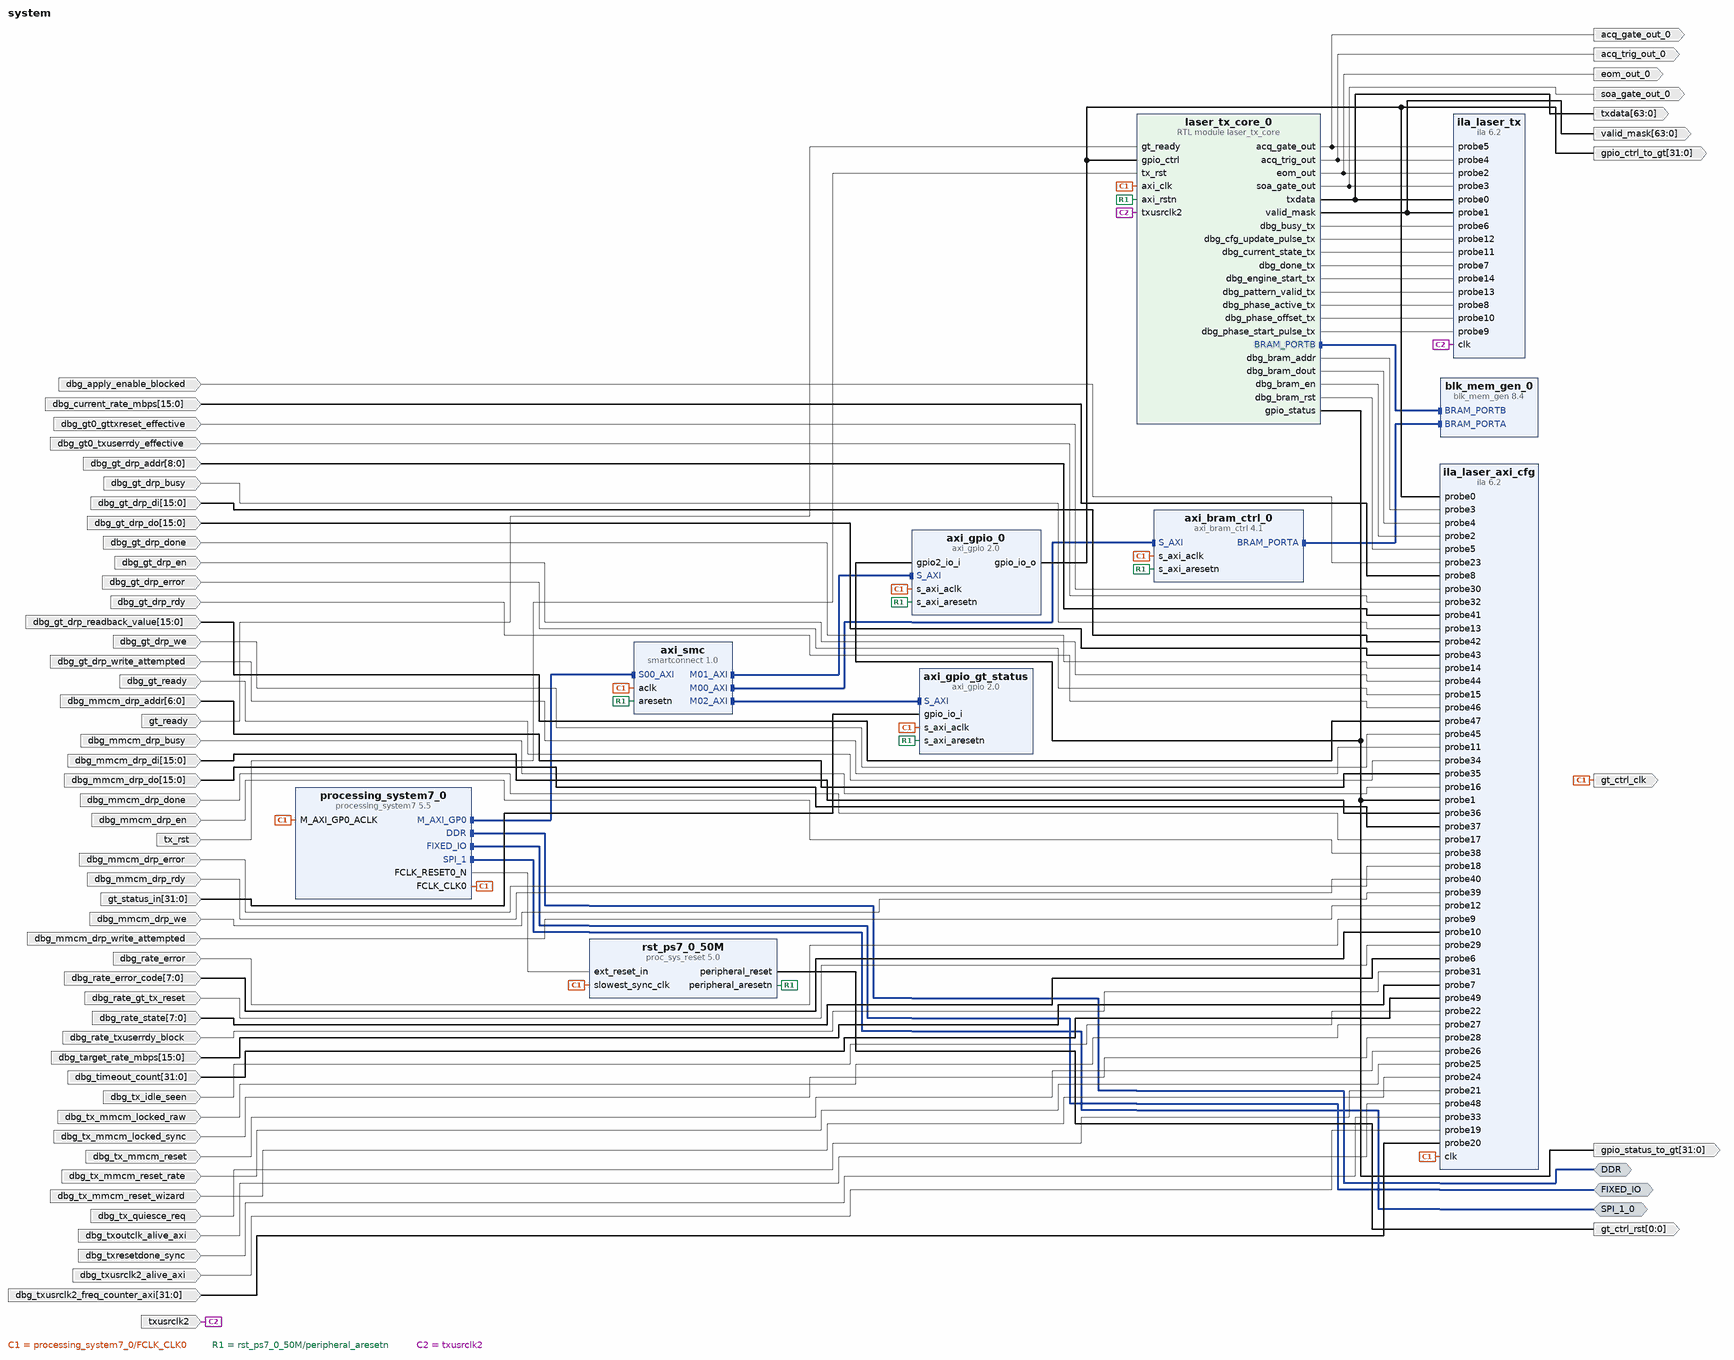
[diagram p0: block diagram of the top level]
# Vivado block design system, xc7z100ffg900-2, Vivado 2022.2
create_bd_design system

create_bd_intf_port -mode Master -vlnv xilinx.com:interface:ddrx_rtl:1.0 DDR
create_bd_intf_port -mode Master -vlnv xilinx.com:display_processing_system7:fixedio_rtl:1.0 FIXED_IO
create_bd_intf_port -mode Master -vlnv xilinx.com:interface:spi_rtl:1.0 SPI_1_0
create_bd_port -dir O acq_trig_out_0
create_bd_port -dir O soa_gate_out_0
create_bd_port -dir O acq_gate_out_0
create_bd_port -dir O eom_out_0
create_bd_port -dir O gt_ctrl_clk
create_bd_port -dir O -from 0 -to 0 gt_ctrl_rst
create_bd_port -dir I txusrclk2
create_bd_port -dir I tx_rst
create_bd_port -dir I gt_ready
create_bd_port -dir O -from 63 -to 0 txdata
create_bd_port -dir O -from 63 -to 0 valid_mask
create_bd_port -dir I -from 31 -to 0 gt_status_in
create_bd_port -dir O -from 31 -to 0 gpio_ctrl_to_gt
create_bd_port -dir O -from 31 -to 0 gpio_status_to_gt
create_bd_port -dir I -from 7 -to 0 dbg_rate_state
create_bd_port -dir I -from 15 -to 0 dbg_target_rate_mbps
create_bd_port -dir I -from 15 -to 0 dbg_current_rate_mbps
create_bd_port -dir I dbg_rate_error
create_bd_port -dir I -from 7 -to 0 dbg_rate_error_code
create_bd_port -dir I dbg_gt_drp_write_attempted
create_bd_port -dir I dbg_mmcm_drp_write_attempted
create_bd_port -dir I dbg_gt_drp_busy
create_bd_port -dir I dbg_gt_drp_done
create_bd_port -dir I dbg_gt_drp_error
create_bd_port -dir I dbg_mmcm_drp_busy
create_bd_port -dir I dbg_mmcm_drp_done
create_bd_port -dir I dbg_mmcm_drp_error
create_bd_port -dir I dbg_txusrclk2_alive_axi
create_bd_port -dir I -from 31 -to 0 dbg_txusrclk2_freq_counter_axi
create_bd_port -dir I dbg_tx_quiesce_req
create_bd_port -dir I dbg_tx_idle_seen
create_bd_port -dir I dbg_apply_enable_blocked
create_bd_port -dir I dbg_tx_mmcm_reset_wizard
create_bd_port -dir I dbg_tx_mmcm_reset_rate
create_bd_port -dir I dbg_tx_mmcm_reset
create_bd_port -dir I dbg_tx_mmcm_locked_raw
create_bd_port -dir I dbg_tx_mmcm_locked_sync
create_bd_port -dir I dbg_rate_gt_tx_reset
create_bd_port -dir I dbg_gt0_gttxreset_effective
create_bd_port -dir I dbg_rate_txuserrdy_block
create_bd_port -dir I dbg_gt0_txuserrdy_effective
create_bd_port -dir I dbg_txresetdone_sync
create_bd_port -dir I dbg_gt_ready
create_bd_port -dir I -from 6 -to 0 dbg_mmcm_drp_addr
create_bd_port -dir I -from 15 -to 0 dbg_mmcm_drp_di
create_bd_port -dir I -from 15 -to 0 dbg_mmcm_drp_do
create_bd_port -dir I dbg_mmcm_drp_en
create_bd_port -dir I dbg_mmcm_drp_we
create_bd_port -dir I dbg_mmcm_drp_rdy
create_bd_port -dir I -from 8 -to 0 dbg_gt_drp_addr
create_bd_port -dir I -from 15 -to 0 dbg_gt_drp_di
create_bd_port -dir I -from 15 -to 0 dbg_gt_drp_do
create_bd_port -dir I dbg_gt_drp_en
create_bd_port -dir I dbg_gt_drp_we
create_bd_port -dir I dbg_gt_drp_rdy
create_bd_port -dir I -from 15 -to 0 dbg_gt_drp_readback_value
create_bd_port -dir I dbg_txoutclk_alive_axi
create_bd_port -dir I -from 31 -to 0 dbg_timeout_count

create_bd_cell -type ip -vlnv xilinx.com:ip:processing_system7:5.5 processing_system7_0
set_property -dict [list \
  CONFIG.PCW_ENET0_ENET0_IO {MIO 16 .. 27} \
  CONFIG.PCW_ENET0_GRP_MDIO_ENABLE 1 \
  CONFIG.PCW_ENET0_GRP_MDIO_IO {MIO 52 .. 53} \
  CONFIG.PCW_ENET0_PERIPHERAL_ENABLE 1 \
  CONFIG.PCW_PRESET_BANK0_VOLTAGE {LVCMOS 1.8V} \
  CONFIG.PCW_PRESET_BANK1_VOLTAGE {LVCMOS 1.8V} \
  CONFIG.PCW_SD0_GRP_CD_ENABLE 0 \
  CONFIG.PCW_SD0_GRP_WP_ENABLE 0 \
  CONFIG.PCW_SD0_PERIPHERAL_ENABLE 1 \
  CONFIG.PCW_SD0_SD0_IO {MIO 40 .. 45} \
  CONFIG.PCW_SD1_PERIPHERAL_ENABLE 1 \
  CONFIG.PCW_SD1_SD1_IO {MIO 10 .. 15} \
  CONFIG.PCW_SDIO_PERIPHERAL_FREQMHZ 100 \
  CONFIG.PCW_SPI1_PERIPHERAL_ENABLE 1 \
  CONFIG.PCW_SPI1_SPI1_IO EMIO \
  CONFIG.PCW_UART1_PERIPHERAL_ENABLE 1 \
  CONFIG.PCW_UART1_UART1_IO {MIO 48 .. 49} \
  CONFIG.PCW_UART_PERIPHERAL_FREQMHZ 100 \
  CONFIG.PCW_UIPARAM_DDR_PARTNO {MT41J256M16 RE-125} \
  CONFIG.PCW_USB0_PERIPHERAL_ENABLE 1 \
  CONFIG.PCW_USB0_USB0_IO {MIO 28 .. 39} \
] [get_bd_cells processing_system7_0]
# 172 more settings of processing_system7_0 are not shown: defaults, MIO pin electricals, DDR timing, and values the tool derives
create_bd_cell -type ip -vlnv xilinx.com:ip:axi_bram_ctrl:4.1 axi_bram_ctrl_0
set_property -dict {CONFIG.SINGLE_PORT_BRAM 1} [get_bd_cells axi_bram_ctrl_0]
create_bd_cell -type ip -vlnv xilinx.com:ip:blk_mem_gen:8.4 blk_mem_gen_0
set_property -dict [list \
  CONFIG.Assume_Synchronous_Clk false \
  CONFIG.EN_SAFETY_CKT false \
  CONFIG.Enable_B Use_ENB_Pin \
  CONFIG.Memory_Type True_Dual_Port_RAM \
  CONFIG.Register_PortB_Output_of_Memory_Core false \
  CONFIG.Register_PortB_Output_of_Memory_Primitives false \
] [get_bd_cells blk_mem_gen_0]
create_bd_cell -type ip -vlnv xilinx.com:ip:axi_gpio:2.0 axi_gpio_0
set_property -dict [list \
  CONFIG.C_ALL_INPUTS_2 1 \
  CONFIG.C_ALL_OUTPUTS 1 \
  CONFIG.C_GPIO2_WIDTH 32 \
  CONFIG.C_GPIO_WIDTH 32 \
  CONFIG.C_IS_DUAL 1 \
] [get_bd_cells axi_gpio_0]
create_bd_cell -type ip -vlnv xilinx.com:ip:smartconnect:1.0 axi_smc
set_property -dict {CONFIG.NUM_MI 3 CONFIG.NUM_SI 1} [get_bd_cells axi_smc]
create_bd_cell -type ip -vlnv xilinx.com:ip:proc_sys_reset:5.0 rst_ps7_0_50M
create_bd_cell -type ip -vlnv xilinx.com:ip:ila:6.2 ila_laser_axi_cfg
set_property -dict [list \
  CONFIG.C_ADV_TRIGGER true \
  CONFIG.C_DATA_DEPTH 4096 \
  CONFIG.C_MONITOR_TYPE Native \
  CONFIG.C_NUM_OF_PROBES 50 \
  CONFIG.C_PROBE0_WIDTH 32 \
  CONFIG.C_PROBE10_WIDTH 8 \
  CONFIG.C_PROBE11_WIDTH 1 \
  CONFIG.C_PROBE12_WIDTH 1 \
  CONFIG.C_PROBE13_WIDTH 1 \
  CONFIG.C_PROBE14_WIDTH 1 \
  CONFIG.C_PROBE15_WIDTH 1 \
  CONFIG.C_PROBE16_WIDTH 1 \
  CONFIG.C_PROBE17_WIDTH 1 \
  CONFIG.C_PROBE18_WIDTH 1 \
  CONFIG.C_PROBE19_WIDTH 1 \
  CONFIG.C_PROBE1_WIDTH 32 \
  CONFIG.C_PROBE20_WIDTH 32 \
  CONFIG.C_PROBE21_WIDTH 1 \
  CONFIG.C_PROBE22_WIDTH 1 \
  CONFIG.C_PROBE23_WIDTH 1 \
  CONFIG.C_PROBE24_WIDTH 1 \
  CONFIG.C_PROBE25_WIDTH 1 \
  CONFIG.C_PROBE26_WIDTH 1 \
  CONFIG.C_PROBE27_WIDTH 1 \
  CONFIG.C_PROBE28_WIDTH 1 \
  CONFIG.C_PROBE29_WIDTH 1 \
  CONFIG.C_PROBE2_WIDTH 1 \
  CONFIG.C_PROBE30_WIDTH 1 \
  CONFIG.C_PROBE31_WIDTH 1 \
  CONFIG.C_PROBE32_WIDTH 1 \
  CONFIG.C_PROBE33_WIDTH 1 \
  CONFIG.C_PROBE34_WIDTH 1 \
  CONFIG.C_PROBE35_WIDTH 7 \
  CONFIG.C_PROBE36_WIDTH 16 \
  CONFIG.C_PROBE37_WIDTH 16 \
  CONFIG.C_PROBE38_WIDTH 1 \
  CONFIG.C_PROBE39_WIDTH 1 \
  CONFIG.C_PROBE3_WIDTH 32 \
  CONFIG.C_PROBE40_WIDTH 1 \
  CONFIG.C_PROBE41_WIDTH 9 \
  CONFIG.C_PROBE42_WIDTH 16 \
  CONFIG.C_PROBE43_WIDTH 16 \
  CONFIG.C_PROBE44_WIDTH 1 \
  CONFIG.C_PROBE45_WIDTH 1 \
  CONFIG.C_PROBE46_WIDTH 1 \
  CONFIG.C_PROBE47_WIDTH 16 \
  CONFIG.C_PROBE48_WIDTH 1 \
  CONFIG.C_PROBE49_WIDTH 32 \
  CONFIG.C_PROBE4_WIDTH 32 \
  CONFIG.C_PROBE5_WIDTH 1 \
  CONFIG.C_PROBE6_WIDTH 8 \
  CONFIG.C_PROBE7_WIDTH 16 \
  CONFIG.C_PROBE8_WIDTH 16 \
  CONFIG.C_PROBE9_WIDTH 1 \
] [get_bd_cells ila_laser_axi_cfg]
create_bd_cell -type ip -vlnv xilinx.com:ip:ila:6.2 ila_laser_tx
set_property -dict [list \
  CONFIG.C_ADV_TRIGGER true \
  CONFIG.C_DATA_DEPTH 4096 \
  CONFIG.C_MONITOR_TYPE Native \
  CONFIG.C_NUM_OF_PROBES 15 \
  CONFIG.C_PROBE0_WIDTH 64 \
  CONFIG.C_PROBE10_WIDTH 8 \
  CONFIG.C_PROBE11_WIDTH 8 \
  CONFIG.C_PROBE12_WIDTH 1 \
  CONFIG.C_PROBE13_WIDTH 1 \
  CONFIG.C_PROBE14_WIDTH 1 \
  CONFIG.C_PROBE1_WIDTH 64 \
  CONFIG.C_PROBE2_WIDTH 1 \
  CONFIG.C_PROBE3_WIDTH 1 \
  CONFIG.C_PROBE4_WIDTH 1 \
  CONFIG.C_PROBE5_WIDTH 1 \
  CONFIG.C_PROBE6_WIDTH 1 \
  CONFIG.C_PROBE7_WIDTH 1 \
  CONFIG.C_PROBE8_WIDTH 1 \
  CONFIG.C_PROBE9_WIDTH 1 \
] [get_bd_cells ila_laser_tx]
create_bd_cell -type ip -vlnv xilinx.com:ip:axi_gpio:2.0 axi_gpio_gt_status
set_property -dict {CONFIG.C_ALL_INPUTS 1 CONFIG.C_GPIO_WIDTH 32 CONFIG.C_IS_DUAL 0} [get_bd_cells axi_gpio_gt_status]
create_bd_cell -type module -reference laser_tx_core laser_tx_core_0

# ---- connections ----

connect_bd_intf_net [get_bd_intf_pins blk_mem_gen_0/BRAM_PORTA] [get_bd_intf_pins axi_bram_ctrl_0/BRAM_PORTA]
connect_bd_intf_net [get_bd_intf_pins axi_smc/M00_AXI] [get_bd_intf_pins axi_bram_ctrl_0/S_AXI]
connect_bd_intf_net [get_bd_intf_pins axi_smc/M01_AXI] [get_bd_intf_pins axi_gpio_0/S_AXI]
connect_bd_intf_net [get_bd_intf_pins axi_smc/M02_AXI] [get_bd_intf_pins axi_gpio_gt_status/S_AXI]
connect_bd_intf_net [get_bd_intf_pins laser_tx_core_0/BRAM_PORTB] [get_bd_intf_pins blk_mem_gen_0/BRAM_PORTB]
connect_bd_intf_net [get_bd_intf_ports DDR] [get_bd_intf_pins processing_system7_0/DDR]
connect_bd_intf_net [get_bd_intf_ports FIXED_IO] [get_bd_intf_pins processing_system7_0/FIXED_IO]
connect_bd_intf_net [get_bd_intf_pins processing_system7_0/M_AXI_GP0] [get_bd_intf_pins axi_smc/S00_AXI]
connect_bd_intf_net [get_bd_intf_ports SPI_1_0] [get_bd_intf_pins processing_system7_0/SPI_1]
connect_bd_net [get_bd_pins axi_gpio_0/gpio_io_o] \
  [get_bd_pins ila_laser_axi_cfg/probe0] [get_bd_ports gpio_ctrl_to_gt] [get_bd_pins laser_tx_core_0/gpio_ctrl]
connect_bd_net [get_bd_ports dbg_apply_enable_blocked] [get_bd_pins ila_laser_axi_cfg/probe23]
connect_bd_net [get_bd_ports dbg_current_rate_mbps] [get_bd_pins ila_laser_axi_cfg/probe8]
connect_bd_net [get_bd_ports dbg_gt0_gttxreset_effective] [get_bd_pins ila_laser_axi_cfg/probe30]
connect_bd_net [get_bd_ports dbg_gt0_txuserrdy_effective] [get_bd_pins ila_laser_axi_cfg/probe32]
connect_bd_net [get_bd_ports dbg_gt_drp_addr] [get_bd_pins ila_laser_axi_cfg/probe41]
connect_bd_net [get_bd_ports dbg_gt_drp_busy] [get_bd_pins ila_laser_axi_cfg/probe13]
connect_bd_net [get_bd_ports dbg_gt_drp_di] [get_bd_pins ila_laser_axi_cfg/probe42]
connect_bd_net [get_bd_ports dbg_gt_drp_do] [get_bd_pins ila_laser_axi_cfg/probe43]
connect_bd_net [get_bd_ports dbg_gt_drp_done] [get_bd_pins ila_laser_axi_cfg/probe14]
connect_bd_net [get_bd_ports dbg_gt_drp_en] [get_bd_pins ila_laser_axi_cfg/probe44]
connect_bd_net [get_bd_ports dbg_gt_drp_error] [get_bd_pins ila_laser_axi_cfg/probe15]
connect_bd_net [get_bd_ports dbg_gt_drp_rdy] [get_bd_pins ila_laser_axi_cfg/probe46]
connect_bd_net [get_bd_ports dbg_gt_drp_readback_value] [get_bd_pins ila_laser_axi_cfg/probe47]
connect_bd_net [get_bd_ports dbg_gt_drp_we] [get_bd_pins ila_laser_axi_cfg/probe45]
connect_bd_net [get_bd_ports dbg_gt_drp_write_attempted] [get_bd_pins ila_laser_axi_cfg/probe11]
connect_bd_net [get_bd_ports dbg_gt_ready] [get_bd_pins ila_laser_axi_cfg/probe34]
connect_bd_net [get_bd_ports dbg_mmcm_drp_addr] [get_bd_pins ila_laser_axi_cfg/probe35]
connect_bd_net [get_bd_ports dbg_mmcm_drp_busy] [get_bd_pins ila_laser_axi_cfg/probe16]
connect_bd_net [get_bd_ports dbg_mmcm_drp_di] [get_bd_pins ila_laser_axi_cfg/probe36]
connect_bd_net [get_bd_ports dbg_mmcm_drp_do] [get_bd_pins ila_laser_axi_cfg/probe37]
connect_bd_net [get_bd_ports dbg_mmcm_drp_done] [get_bd_pins ila_laser_axi_cfg/probe17]
connect_bd_net [get_bd_ports dbg_mmcm_drp_en] [get_bd_pins ila_laser_axi_cfg/probe38]
connect_bd_net [get_bd_ports dbg_mmcm_drp_error] [get_bd_pins ila_laser_axi_cfg/probe18]
connect_bd_net [get_bd_ports dbg_mmcm_drp_rdy] [get_bd_pins ila_laser_axi_cfg/probe40]
connect_bd_net [get_bd_ports dbg_mmcm_drp_we] [get_bd_pins ila_laser_axi_cfg/probe39]
connect_bd_net [get_bd_ports dbg_mmcm_drp_write_attempted] [get_bd_pins ila_laser_axi_cfg/probe12]
connect_bd_net [get_bd_ports dbg_rate_error] [get_bd_pins ila_laser_axi_cfg/probe9]
connect_bd_net [get_bd_ports dbg_rate_error_code] [get_bd_pins ila_laser_axi_cfg/probe10]
connect_bd_net [get_bd_ports dbg_rate_gt_tx_reset] [get_bd_pins ila_laser_axi_cfg/probe29]
connect_bd_net [get_bd_ports dbg_rate_state] [get_bd_pins ila_laser_axi_cfg/probe6]
connect_bd_net [get_bd_ports dbg_rate_txuserrdy_block] [get_bd_pins ila_laser_axi_cfg/probe31]
connect_bd_net [get_bd_ports dbg_target_rate_mbps] [get_bd_pins ila_laser_axi_cfg/probe7]
connect_bd_net [get_bd_ports dbg_timeout_count] [get_bd_pins ila_laser_axi_cfg/probe49]
connect_bd_net [get_bd_ports dbg_tx_idle_seen] [get_bd_pins ila_laser_axi_cfg/probe22]
connect_bd_net [get_bd_ports dbg_tx_mmcm_locked_raw] [get_bd_pins ila_laser_axi_cfg/probe27]
connect_bd_net [get_bd_ports dbg_tx_mmcm_locked_sync] [get_bd_pins ila_laser_axi_cfg/probe28]
connect_bd_net [get_bd_ports dbg_tx_mmcm_reset] [get_bd_pins ila_laser_axi_cfg/probe26]
connect_bd_net [get_bd_ports dbg_tx_mmcm_reset_rate] [get_bd_pins ila_laser_axi_cfg/probe25]
connect_bd_net [get_bd_ports dbg_tx_mmcm_reset_wizard] [get_bd_pins ila_laser_axi_cfg/probe24]
connect_bd_net [get_bd_ports dbg_tx_quiesce_req] [get_bd_pins ila_laser_axi_cfg/probe21]
connect_bd_net [get_bd_ports dbg_txoutclk_alive_axi] [get_bd_pins ila_laser_axi_cfg/probe48]
connect_bd_net [get_bd_ports dbg_txresetdone_sync] [get_bd_pins ila_laser_axi_cfg/probe33]
connect_bd_net [get_bd_ports dbg_txusrclk2_alive_axi] [get_bd_pins ila_laser_axi_cfg/probe19]
connect_bd_net [get_bd_ports dbg_txusrclk2_freq_counter_axi] [get_bd_pins ila_laser_axi_cfg/probe20]
connect_bd_net [get_bd_ports gt_ready] [get_bd_pins laser_tx_core_0/gt_ready]
connect_bd_net [get_bd_ports gt_status_in] [get_bd_pins axi_gpio_gt_status/gpio_io_i]
connect_bd_net [get_bd_pins laser_tx_core_0/acq_gate_out] [get_bd_ports acq_gate_out_0] [get_bd_pins ila_laser_tx/probe5]
connect_bd_net [get_bd_pins laser_tx_core_0/acq_trig_out] [get_bd_ports acq_trig_out_0] [get_bd_pins ila_laser_tx/probe4]
connect_bd_net [get_bd_pins laser_tx_core_0/dbg_bram_addr] [get_bd_pins ila_laser_axi_cfg/probe3]
connect_bd_net [get_bd_pins laser_tx_core_0/dbg_bram_dout] [get_bd_pins ila_laser_axi_cfg/probe4]
connect_bd_net [get_bd_pins laser_tx_core_0/dbg_bram_en] [get_bd_pins ila_laser_axi_cfg/probe2]
connect_bd_net [get_bd_pins laser_tx_core_0/dbg_bram_rst] [get_bd_pins ila_laser_axi_cfg/probe5]
connect_bd_net [get_bd_pins laser_tx_core_0/dbg_busy_tx] [get_bd_pins ila_laser_tx/probe6]
connect_bd_net [get_bd_pins laser_tx_core_0/dbg_cfg_update_pulse_tx] [get_bd_pins ila_laser_tx/probe12]
connect_bd_net [get_bd_pins laser_tx_core_0/dbg_current_state_tx] [get_bd_pins ila_laser_tx/probe11]
connect_bd_net [get_bd_pins laser_tx_core_0/dbg_done_tx] [get_bd_pins ila_laser_tx/probe7]
connect_bd_net [get_bd_pins laser_tx_core_0/dbg_engine_start_tx] [get_bd_pins ila_laser_tx/probe14]
connect_bd_net [get_bd_pins laser_tx_core_0/dbg_pattern_valid_tx] [get_bd_pins ila_laser_tx/probe13]
connect_bd_net [get_bd_pins laser_tx_core_0/dbg_phase_active_tx] [get_bd_pins ila_laser_tx/probe8]
connect_bd_net [get_bd_pins laser_tx_core_0/dbg_phase_offset_tx] [get_bd_pins ila_laser_tx/probe10]
connect_bd_net [get_bd_pins laser_tx_core_0/dbg_phase_start_pulse_tx] [get_bd_pins ila_laser_tx/probe9]
connect_bd_net [get_bd_pins laser_tx_core_0/eom_out] [get_bd_ports eom_out_0] [get_bd_pins ila_laser_tx/probe2]
connect_bd_net [get_bd_pins laser_tx_core_0/gpio_status] \
  [get_bd_pins axi_gpio_0/gpio2_io_i] [get_bd_pins ila_laser_axi_cfg/probe1] [get_bd_ports gpio_status_to_gt]
connect_bd_net [get_bd_pins laser_tx_core_0/soa_gate_out] [get_bd_ports soa_gate_out_0] [get_bd_pins ila_laser_tx/probe3]
connect_bd_net [get_bd_pins laser_tx_core_0/txdata] [get_bd_pins ila_laser_tx/probe0] [get_bd_ports txdata]
connect_bd_net [get_bd_pins laser_tx_core_0/valid_mask] [get_bd_pins ila_laser_tx/probe1] [get_bd_ports valid_mask]
connect_bd_net [get_bd_pins processing_system7_0/FCLK_CLK0] \
  [get_bd_pins processing_system7_0/M_AXI_GP0_ACLK] [get_bd_pins axi_smc/aclk] [get_bd_pins axi_bram_ctrl_0/s_axi_aclk] \
  [get_bd_pins rst_ps7_0_50M/slowest_sync_clk] [get_bd_pins axi_gpio_0/s_axi_aclk] [get_bd_pins ila_laser_axi_cfg/clk] \
  [get_bd_pins axi_gpio_gt_status/s_axi_aclk] [get_bd_ports gt_ctrl_clk] [get_bd_pins laser_tx_core_0/axi_clk]
connect_bd_net [get_bd_pins processing_system7_0/FCLK_RESET0_N] [get_bd_pins rst_ps7_0_50M/ext_reset_in]
connect_bd_net [get_bd_pins rst_ps7_0_50M/peripheral_aresetn] \
  [get_bd_pins axi_bram_ctrl_0/s_axi_aresetn] [get_bd_pins axi_smc/aresetn] [get_bd_pins axi_gpio_0/s_axi_aresetn] \
  [get_bd_pins axi_gpio_gt_status/s_axi_aresetn] [get_bd_pins laser_tx_core_0/axi_rstn]
connect_bd_net [get_bd_pins rst_ps7_0_50M/peripheral_reset] [get_bd_ports gt_ctrl_rst]
connect_bd_net [get_bd_ports tx_rst] [get_bd_pins laser_tx_core_0/tx_rst]
connect_bd_net -net txusrclk2_1 [get_bd_ports txusrclk2] [get_bd_pins ila_laser_tx/clk] [get_bd_pins laser_tx_core_0/txusrclk2]
set_property HDL_ATTRIBUTE.BMM_INFO_PROCESSOR {arm > system axi_bram_ctrl_0} [get_bd_cells processing_system7_0]
set_property HDL_ATTRIBUTE.KEEP_HIERARCHY yes [get_bd_cells processing_system7_0]
set_property HDL_ATTRIBUTE.BMM_INFO_ADDRESS_SPACE {byte  0x40000000 32 > system blk_mem_gen_0} [get_bd_cells axi_bram_ctrl_0]
set_property HDL_ATTRIBUTE.KEEP_HIERARCHY yes [get_bd_cells axi_bram_ctrl_0]

# ---- address map ----
assign_bd_address -offset 0x40000000 -range 8K -target_address_space [get_bd_addr_spaces processing_system7_0/Data] [get_bd_addr_segs axi_bram_ctrl_0/S_AXI/Mem0]
assign_bd_address -offset 0x40020000 -range 64K -target_address_space [get_bd_addr_spaces processing_system7_0/Data] [get_bd_addr_segs axi_gpio_gt_status/S_AXI/Reg]
assign_bd_address -offset 0x41200000 -range 64K -target_address_space [get_bd_addr_spaces processing_system7_0/Data] [get_bd_addr_segs axi_gpio_0/S_AXI/Reg]

validate_bd_design
save_bd_design
